# Altium schematic sheet Sheet1.SchDoc
size B
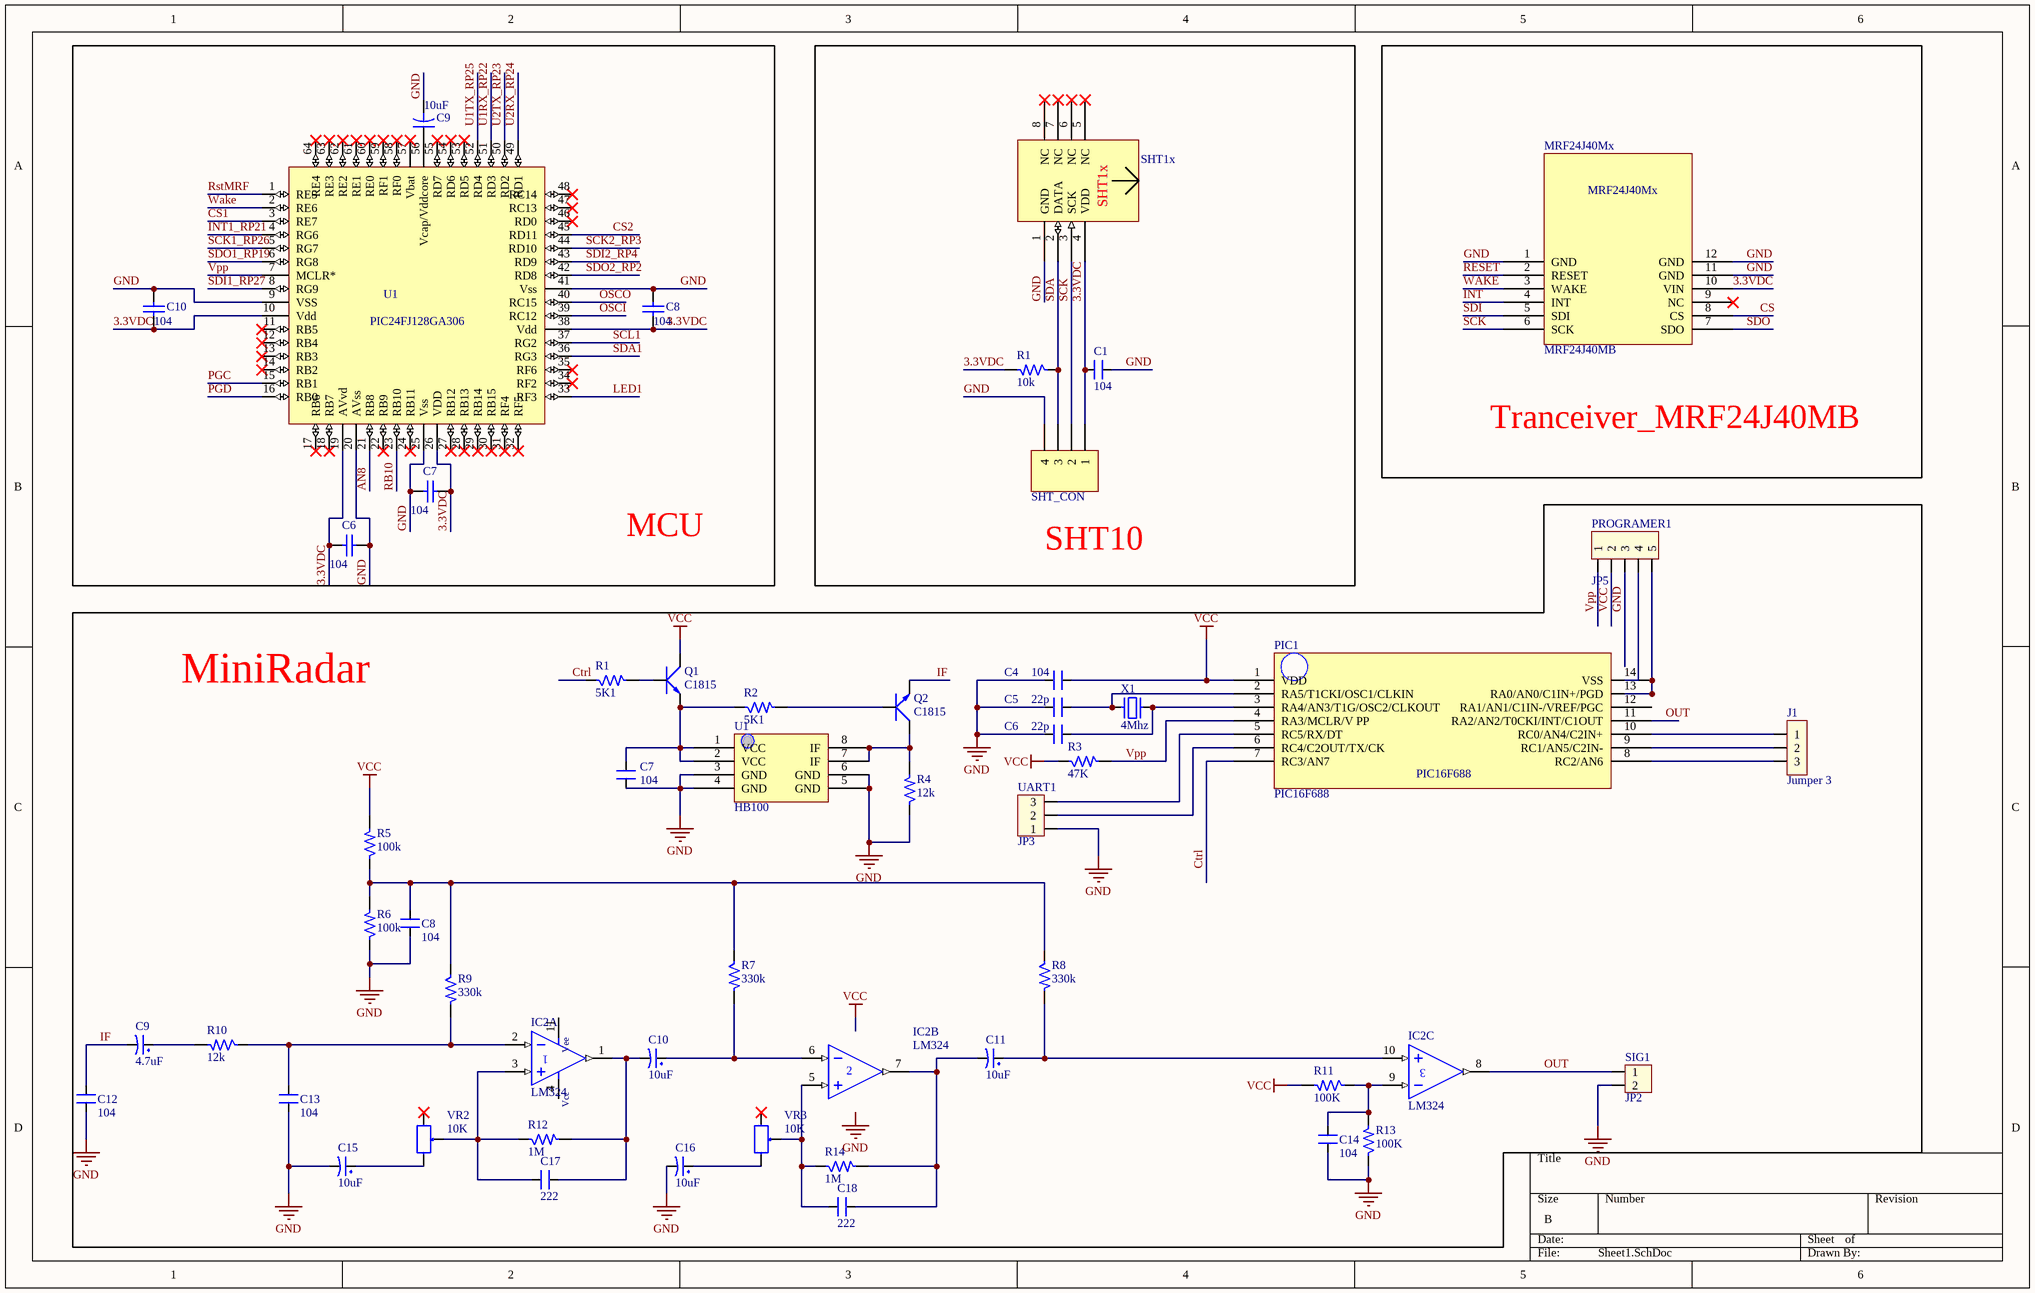
[diagram p0: Sheet1.SchDoc]

## Parts
(Parts that share a designator on the sheet are numbered #1, #2 ... from top to bottom, then left to right.)
C1  104  [C0805]
C4  104  [SM-0805]
C5  22p  [SM-0805]
C6#1  value 104  [C0805]  (hidden comment: Cap)
C6#2  22p  [SM-0805]
C7#1  value 104  [C0805]  (hidden comment: Cap)
C7#2  104  [SM-0805]
C8#1  value 104  [C0805]  (hidden comment: Cap)
C8#2  104  [SM-0805]
C9#1  value 10uF  [CAP P 6.3x5.4]  (hidden comment: Cap2)
C9#2  4.7uF  [CP1/2.5]
C10#1  value 104  [C0805]  (hidden comment: Cap)
C10#2  10uF  [CP1/2.5]
C11  10uF  [CP1/2.5]
C12  104  [SM-0805]
C13  104  [SM-0805]
C14  104  [SM-0805]
C15  10uF  [CP1/2.5]
C16  10uF  [CP1/2.5]
C17  222  [SM-0805]
C18  222  [SM-0805]
IC2  LM324  [SO-14]  (parts A,B,C of 4)
J1  Jumper 3  [JP3]
MRF24J40Mx  MRF24J40MB  [MRF24J40MB]
PIC1  PIC16F688  [SO-14]
PROGRAMER1  JP5  [CON5]
Q1  C1815  [SOT23B]
Q2  C1815  [SOT23B]
R1#1  10k  [C0805]
R1#2  5K1  [SM-0805]
R2  5K1  [SM-0805]
R3  47K  [SM-0805]
R4  12k  [SM-0805]
R5  100k  [SM-0805]
R6  100k  [SM-0805]
R7  330k  [SM-0805]
R8  330k  [SM-0805]
R9  330k  [SM-0805]
R10  12k  [SM-0805]
R11  100K  [SM-0805]
R12  1M  [SM-0805]
R13  100K  [SM-0805]
R14  1M  [SM-0805]
SHT1x  SHT1x  [SHT1x]  (value not drawn)
SHT_CON  SHTCON  [HDR1X4]  (value not drawn)
SIG1  JP2  [CON2]
U1#1  PIC24FJ128GA306  [TQFP-PT64_N]
U1#2  HB100  [HB100_SENSOR]
UART1  JP3  [CON3]
VR2  10K  [VR]
VR3  10K  [VR]
X1  4Mhz  [XT2]

## Blocks framed on the sheet
MCU: C6#1 C7#1 C8#1 C9#1 C10#1 U1#1
SHT10: C1 R1#1 SHT1x SHT_CON
Tranceiver_MRF24J40MB: MRF24J40Mx
MiniRadar: C4 C5 C6#2 C7#2 C8#2 C9#2 C10#2 C11-C18 IC2 J1 PIC1 PROGRAMER1 Q1 Q2 R1#2 R2-R14 SIG1 U1#2 UART1 VR2 VR3 X1

## Nets
GND: C1.1 C4.1 C5.1 C6#1.2 C6#2.1 C7#1.1 C7#2.1 C8#1.2 C8#2.1 C9#1.2 C10#1.2 C12.1 C13.1 C14.1 C15.2 C16.2 MRF24J40Mx.1(GND) MRF24J40Mx.11(GND) MRF24J40Mx.12(GND) PROGRAMER1.3 R4.1 R6.1 R13.1 SHT1x.1(GND) SHT_CON.4 SIG1.2 U1#1.9(VSS) U1#1.20(AVss) U1#1.25(Vss) U1#1.41(Vss) U1#2.3(GND) U1#2.4(GND) U1#2.5(GND) U1#2.6(GND) UART1.1
VCC: C4.2 PIC1.1(VDD) PROGRAMER1.2 Q1.2(C) R3.1 R5.2 R11.2
3.3VDC: C1.2 C6#1.1 C7#1.2 C8#1.1 C10#1.1 MRF24J40Mx.10(VIN) R1#1.2 SHT1x.4(VDD) SHT_CON.1 U1#1.10(Vdd) U1#1.19(AVvd) U1#1.26(VDD) U1#1.38(Vdd)
AN8: U1#1.21(RB8)
CS: MRF24J40Mx.8(CS)
CS1: U1#1.3(RE7)
CS2: U1#1.45(RD11)
Ctrl: PIC1.7(RC3/AN7) R1#2.1
IF: C9#2.2 C12.2 Q2.1(E)
INT: MRF24J40Mx.4(INT)
INT1_RP21: U1#1.4(RG6)
LED1: U1#1.33(RF3)
OSCI: U1#1.39(RC12)
OSCO: U1#1.40(RC15)
OUT: IC2.8(OUT) PIC1.11(RA2/AN2/T0CKI/INT/C1OUT) SIG1.1
PGC: U1#1.15(RB1)
PGD: U1#1.16(RB0)
RB10: U1#1.23(RB10)
RESET: MRF24J40Mx.2(RESET)
RstMRF: U1#1.1(RE5)
SCK: MRF24J40Mx.6(SCK) SHT1x.3(SCK) SHT_CON.2
SCK1_RP26: U1#1.5(RG7)
SCK2_RP3: U1#1.44(RD10)
SCL1: U1#1.37(RG2)
SDA: R1#1.1 SHT1x.2(DATA) SHT_CON.3
SDA1: U1#1.36(RG3)
SDI: MRF24J40Mx.5(SDI)
SDI1_RP27: U1#1.8(RG9)
SDI2_RP4: U1#1.43(RD9)
SDO: MRF24J40Mx.7(SDO)
SDO1_RP19: U1#1.6(RG8)
SDO2_RP2: U1#1.42(RD8)
U1RX_RP22: U1#1.51(RD3)
U1TX_RP25: U1#1.52(RD4)
U2RX_RP24: U1#1.49(RD1)
U2TX_RP23: U1#1.50(RD2)
Vpp: PIC1.4(RA3/MCLR/V_PP) PROGRAMER1.1 R3.2 U1#1.7(MCLR*)
Wake: MRF24J40Mx.3(WAKE) U1#1.2(RE6)
NetC5_2: C5.2 PIC1.2(RA5/T1CKI/OSC1/CLKIN) X1.1
NetC6#2_2: C6#2.2 PIC1.3(RA4/AN3/T1G/OSC2/CLKOUT) X1.2
NetC7#2_2: C7#2.2 Q1.1(E) R2.1 U1#2.1(VCC) U1#2.2(VCC)
NetC8#2_2: C8#2.2 R5.1 R6.2 R7.1 R8.1 R9.1
NetC9#1_1: C9#1.1 U1#1.56(Vcap/Vddcore)
NetC9#2_1: C9#2.1 R10.2
NetC10#2_1: C10#2.1 IC2.6(IN-) R7.2
NetC10#2_2: C10#2.2 C17.2 IC2.1(OUT) R12.2
NetC11_1: C11.1 IC2.10(IN+) R8.2
NetC11_2: C11.2 C18.2 IC2.7(OUT) R14.2
NetC13_2: C13.2 IC2.2(IN-) R9.2 R10.1
NetC14_2: C14.2 IC2.9(IN-) R11.1 R13.2
NetC15_1: C15.1 VR2.3
NetC16_1: C16.1 VR3.3
NetC17_1: C17.1 IC2.3(IN+) R12.1 VR2.2
NetC18_1: C18.1 IC2.5(IN+) R14.1 VR3.2
NetJ1_1: J1.1 PIC1.10(RC0/AN4/C2IN+)
NetJ1_2: J1.2 PIC1.9(RC1/AN5/C2IN-)
NetJ1_3: J1.3 PIC1.8(RC2/AN6)
NetPIC1_5: PIC1.5(RC5/RX/DT) UART1.3
NetPIC1_6: PIC1.6(RC4/C2OUT/TX/CK) UART1.2
NetPIC1_13: PIC1.13(RA0/AN0/C1IN+/PGD) PIC1.14(VSS) PROGRAMER1.5
NetQ1_3: Q1.3(B) R1#2.2
NetQ2_2: Q2.2(C) R4.2 U1#2.7(IF) U1#2.8(IF)
NetQ2_3: Q2.3(B) R2.2

Not connected (* = marked no-connect by the designer): IC2 4(V+) 11(V-); MRF24J40Mx 9(NC)*; PIC1 12(RA1/AN1/C1IN-/VREF/PGC); PROGRAMER1 4; SHT1x 5(NC)* 6(NC)* 7(NC)* 8(NC)*; U1#1 11(RB5)* 12(RB4)* 13(RB3)* 14(RB2)* 17(RB6)* 18(RB7)* 22(RB9)* 24(RB11)* 27(RB12)* 28(RB13)* 29(RB14)* 30(RB15)* 31(RF4)* 32(RF5)* 34(RF2)* 35(RF6)* 46(RD0)* 47(RC13)* 48(RC14)* 53(RD5)* 54(RD6)* 55(RD7)* 57(Vbat)* 58(RF0)* 59(RF1)* 60(RE0)* 61(RE1)* 62(RE2)* 63(RE3)* 64(RE4)*; VR2 1*; VR3 1*

## Notes on the sheet
- Labels drawn without touching a wire or pin: GND
- (in symbol LM324, part A) Vee; Vcc

## Library data of the parts
C1 C4 C5 C6#2 = CM: Cap SMD; Value: 103
C6#1 C7#1 C8#1 C10#1 = Cap: Capacitor; Published: 8-Jun-2000; LatestRevisionDate: 17-Jul-2002; LatestRevisionNote: Re-released for DXP Platform.; PackageReference: RAD-0.3; Publisher: Altium Limited; PackageDescription: Radial Cap, Thru-Hole; 2 Leads; 0.3 in Pin Spacing
C7#2 C8#2 C12-C14 C17 C18 = CN2: Cap np 104 => 105pF; Value: 0.1uF; Description: Cap np Cremic Value  104pF => 105pF
C9#1 = Cap2: Capacitor; Published: 23-Sep-2002; PackageReference: CAPR5-4X5; Publisher: Altium Limited; PackageDescription: Capacitor; 2 Leads
C9#2 C10#2 C11 C15 C16 = CP1: Cap P  0,1uF < 22uF , 16 - 50V; Value: 10uF/50V; Description 1: 10 => 220uF/6,3V/10V - 10uF => 100uF/16V; Description 2: 0,1uF => 33uF/50V - 10uF => 22uF/63V; Description 3: 0,47uF => 10uF/100V
IC2 = LM324: Op x 4; Value: LM324
J1 = JP3: Value: J3
PROGRAMER1 = Con5: Connector 5; Value: Connector 5
Q1 Q2 = C1815: NPN 600mW, ECB; Value: C1815
R1#1 R1#2 R2-R14 = R: Resistor 1/4W; Value: R1/4W - 1K
SHT_CON = Header 4: Header, 4-Pin; LatestRevisionDate: 17-Jul-2002; LatestRevisionNote: Re-released for DXP Platform.; Publisher: Altium Limited
SIG1 = Con2: Connector 2; Value: Connector 2
U1#2 = HB100_SENSOR
UART1 = Con3: Connector 3; Value: Connector 3
VR2 VR3 = VR: Var Resistor; Value: VR 10K
X1 = XT2: Crystal For all Crystal 2pin.; Value: 4Mhz